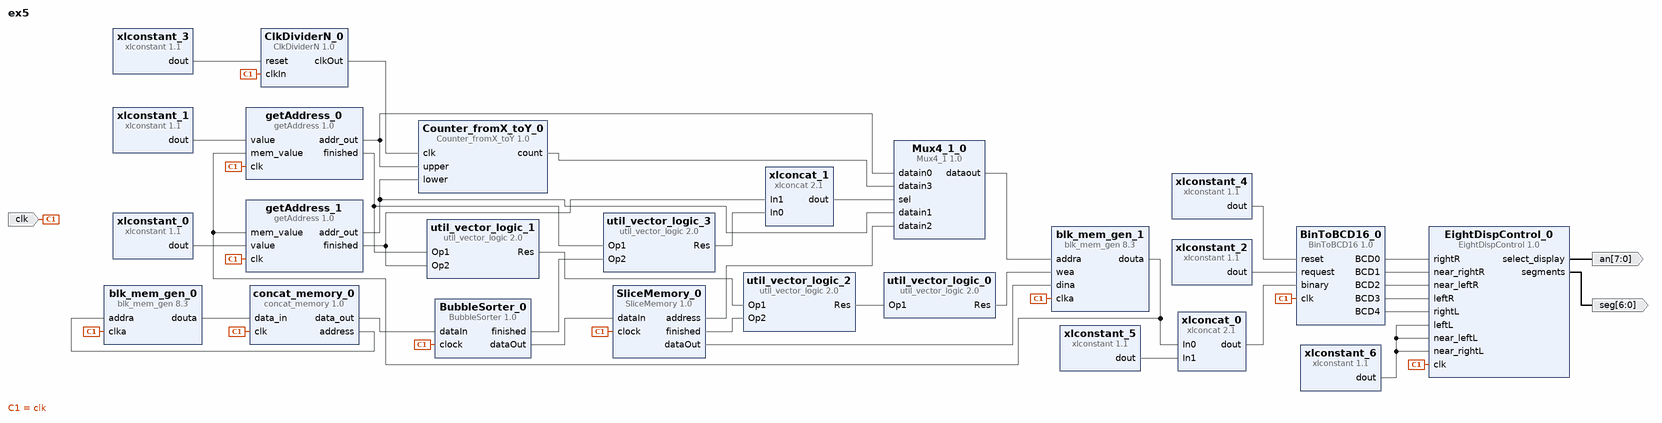
[diagram p0: block diagram of the top level]
# Vivado block design ex5, xc7a100tcsg324-3, Vivado 2016.4
create_bd_design ex5

create_bd_port -dir I clk
create_bd_port -dir O -from 6 -to 0 seg
create_bd_port -dir O -from 7 -to 0 an

create_bd_cell -type ip -vlnv xilinx.com:ip:xlconstant:1.1 xlconstant_1
set_property -dict {CONFIG.CONST_WIDTH 8 CONFIG.CONST_VAL 120} [get_bd_cells xlconstant_1]
create_bd_cell -type ip -vlnv xilinx.com:ip:xlconstant:1.1 xlconstant_0
set_property -dict {CONFIG.CONST_WIDTH 8 CONFIG.CONST_VAL 44} [get_bd_cells xlconstant_0]
create_bd_cell -type ip -vlnv xilinx.com:user:getAddress:1.0 getAddress_0
create_bd_cell -type ip -vlnv xilinx.com:user:Counter_fromX_toY:1.0 Counter_fromX_toY_0
create_bd_cell -type ip -vlnv xilinx.com:user:getAddress:1.0 getAddress_1
create_bd_cell -type ip -vlnv xilinx.com:user:Mux4_1:1.0 Mux4_1_0
create_bd_cell -type ip -vlnv xilinx.com:ip:xlconcat:2.1 xlconcat_1
set_property -dict {CONFIG.IN0_WIDTH 1 CONFIG.IN1_WIDTH 1} [get_bd_cells xlconcat_1]
create_bd_cell -type ip -vlnv xilinx.com:user:ClkDividerN:1.0 ClkDividerN_0
set_property -dict {CONFIG.divFactor 100000000} [get_bd_cells ClkDividerN_0]
create_bd_cell -type ip -vlnv xilinx.com:ip:xlconstant:1.1 xlconstant_3
set_property -dict {CONFIG.CONST_VAL 0} [get_bd_cells xlconstant_3]
create_bd_cell -type ip -vlnv xilinx.com:ip:blk_mem_gen:8.3 blk_mem_gen_0
set_property -dict [list \
  CONFIG.Memory_Type Single_Port_ROM \
  CONFIG.Enable_32bit_Address false \
  CONFIG.Write_Width_A 8 \
  CONFIG.Enable_A Always_Enabled \
  CONFIG.Register_PortA_Output_of_Memory_Primitives true \
  CONFIG.Load_Init_File true \
  CONFIG.Coe_File ../../../../../../../ex1/vector16_8bits_random.coe \
  CONFIG.Use_RSTA_Pin false \
  CONFIG.Port_A_Write_Rate 0 \
  CONFIG.use_bram_block Stand_Alone \
] [get_bd_cells blk_mem_gen_0]
create_bd_cell -type ip -vlnv xilinx.com:user:concat_memory:1.0 concat_memory_0
set_property -dict {CONFIG.bits 8 CONFIG.words 16 CONFIG.log_words 4} [get_bd_cells concat_memory_0]
create_bd_cell -type ip -vlnv xilinx.com:ip:blk_mem_gen:8.3 blk_mem_gen_1
set_property -dict [list \
  CONFIG.Enable_32bit_Address false \
  CONFIG.Use_Byte_Write_Enable false \
  CONFIG.Write_Width_A 8 \
  CONFIG.Read_Width_A 8 \
  CONFIG.Enable_A Always_Enabled \
  CONFIG.Register_PortA_Output_of_Memory_Primitives true \
  CONFIG.Use_RSTA_Pin false \
  CONFIG.use_bram_block Stand_Alone \
] [get_bd_cells blk_mem_gen_1]
create_bd_cell -type ip -vlnv xilinx.com:user:BubbleSorter:1.0 BubbleSorter_0
create_bd_cell -type ip -vlnv xilinx.com:ip:util_vector_logic:2.0 util_vector_logic_1
set_property -dict {CONFIG.C_SIZE 1} [get_bd_cells util_vector_logic_1]
create_bd_cell -type ip -vlnv xilinx.com:ip:util_vector_logic:2.0 util_vector_logic_0
set_property -dict {CONFIG.C_SIZE 1 CONFIG.C_OPERATION not} [get_bd_cells util_vector_logic_0]
create_bd_cell -type ip -vlnv xilinx.com:ip:util_vector_logic:2.0 util_vector_logic_3
set_property -dict {CONFIG.C_SIZE 1} [get_bd_cells util_vector_logic_3]
create_bd_cell -type ip -vlnv ua.pt:user:EightDispControl:1.0 EightDispControl_0
create_bd_cell -type ip -vlnv ua.pt:user:BinToBCD16:1.0 BinToBCD16_0
create_bd_cell -type ip -vlnv xilinx.com:ip:xlconstant:1.1 xlconstant_2
create_bd_cell -type ip -vlnv xilinx.com:ip:xlconstant:1.1 xlconstant_4
set_property -dict {CONFIG.CONST_VAL 0} [get_bd_cells xlconstant_4]
create_bd_cell -type ip -vlnv xilinx.com:ip:xlconcat:2.1 xlconcat_0
set_property -dict {CONFIG.IN0_WIDTH 8 CONFIG.IN1_WIDTH 8} [get_bd_cells xlconcat_0]
create_bd_cell -type ip -vlnv xilinx.com:ip:xlconstant:1.1 xlconstant_5
set_property -dict {CONFIG.CONST_WIDTH 8 CONFIG.CONST_VAL 0} [get_bd_cells xlconstant_5]
create_bd_cell -type ip -vlnv xilinx.com:ip:xlconstant:1.1 xlconstant_6
set_property -dict {CONFIG.CONST_WIDTH 4 CONFIG.CONST_VAL 0} [get_bd_cells xlconstant_6]
create_bd_cell -type ip -vlnv xilinx.com:ip:util_vector_logic:2.0 util_vector_logic_2
set_property -dict {CONFIG.C_SIZE 1} [get_bd_cells util_vector_logic_2]
create_bd_cell -type ip -vlnv xilinx.com:user:SliceMemory:1.0 SliceMemory_0

# ---- connections ----

connect_bd_net [get_bd_pins xlconstant_1/dout] [get_bd_pins getAddress_0/value]
connect_bd_net [get_bd_ports clk] \
  [get_bd_pins getAddress_0/clk] [get_bd_pins ClkDividerN_0/clkIn] [get_bd_pins blk_mem_gen_0/clka] \
  [get_bd_pins getAddress_1/clk] [get_bd_pins concat_memory_0/clk] [get_bd_pins blk_mem_gen_1/clka] \
  [get_bd_pins BubbleSorter_0/clock] [get_bd_pins BinToBCD16_0/clk] [get_bd_pins EightDispControl_0/clk] \
  [get_bd_pins SliceMemory_0/clock]
connect_bd_net [get_bd_pins getAddress_0/addr_out] [get_bd_pins Mux4_1_0/datain0] [get_bd_pins Counter_fromX_toY_0/upper]
connect_bd_net [get_bd_pins getAddress_1/addr_out] [get_bd_pins Mux4_1_0/datain1] [get_bd_pins Counter_fromX_toY_0/lower]
connect_bd_net [get_bd_pins getAddress_1/finished] [get_bd_pins xlconcat_1/In1] [get_bd_pins util_vector_logic_1/Op2]
connect_bd_net [get_bd_pins xlconcat_1/dout] [get_bd_pins Mux4_1_0/sel]
connect_bd_net [get_bd_pins ClkDividerN_0/clkOut] [get_bd_pins Counter_fromX_toY_0/clk]
connect_bd_net [get_bd_pins xlconstant_3/dout] [get_bd_pins ClkDividerN_0/reset]
connect_bd_net [get_bd_pins blk_mem_gen_0/douta] [get_bd_pins concat_memory_0/data_in]
connect_bd_net [get_bd_pins concat_memory_0/address] [get_bd_pins blk_mem_gen_0/addra]
connect_bd_net [get_bd_pins concat_memory_0/data_out] [get_bd_pins BubbleSorter_0/dataIn]
connect_bd_net [get_bd_pins BubbleSorter_0/dataOut] [get_bd_pins SliceMemory_0/dataIn]
connect_bd_net [get_bd_pins SliceMemory_0/dataOut] [get_bd_pins blk_mem_gen_1/dina]
connect_bd_net [get_bd_pins util_vector_logic_0/Res] [get_bd_pins blk_mem_gen_1/wea]
connect_bd_net [get_bd_pins Mux4_1_0/dataout] [get_bd_pins blk_mem_gen_1/addra]
connect_bd_net [get_bd_pins Counter_fromX_toY_0/count] [get_bd_pins Mux4_1_0/datain3]
connect_bd_net [get_bd_pins SliceMemory_0/address] [get_bd_pins Mux4_1_0/datain2]
connect_bd_net [get_bd_pins getAddress_0/finished] [get_bd_pins util_vector_logic_1/Op1] [get_bd_pins util_vector_logic_3/Op1]
connect_bd_net [get_bd_pins BubbleSorter_0/finished] [get_bd_pins util_vector_logic_3/Op2]
connect_bd_net [get_bd_pins util_vector_logic_3/Res] [get_bd_pins xlconcat_1/In0]
connect_bd_net [get_bd_pins xlconstant_0/dout] [get_bd_pins getAddress_1/value]
connect_bd_net [get_bd_pins blk_mem_gen_1/douta] \
  [get_bd_pins getAddress_1/mem_value] [get_bd_pins getAddress_0/mem_value] [get_bd_pins xlconcat_0/In0]
connect_bd_net [get_bd_pins xlconstant_4/dout] [get_bd_pins BinToBCD16_0/reset]
connect_bd_net [get_bd_pins xlconstant_2/dout] [get_bd_pins BinToBCD16_0/request]
connect_bd_net [get_bd_pins xlconstant_5/dout] [get_bd_pins xlconcat_0/In1]
connect_bd_net [get_bd_pins xlconcat_0/dout] [get_bd_pins BinToBCD16_0/binary]
connect_bd_net [get_bd_pins BinToBCD16_0/BCD0] [get_bd_pins EightDispControl_0/rightR]
connect_bd_net [get_bd_pins BinToBCD16_0/BCD1] [get_bd_pins EightDispControl_0/near_rightR]
connect_bd_net [get_bd_pins BinToBCD16_0/BCD2] [get_bd_pins EightDispControl_0/near_leftR]
connect_bd_net [get_bd_pins BinToBCD16_0/BCD3] [get_bd_pins EightDispControl_0/leftR]
connect_bd_net [get_bd_pins BinToBCD16_0/BCD4] [get_bd_pins EightDispControl_0/rightL]
connect_bd_net [get_bd_pins xlconstant_6/dout] \
  [get_bd_pins EightDispControl_0/near_rightL] [get_bd_pins EightDispControl_0/near_leftL] \
  [get_bd_pins EightDispControl_0/leftL]
connect_bd_net [get_bd_pins EightDispControl_0/segments] [get_bd_ports seg]
connect_bd_net [get_bd_pins EightDispControl_0/select_display] [get_bd_ports an]
connect_bd_net [get_bd_pins util_vector_logic_2/Res] [get_bd_pins util_vector_logic_0/Op1]
connect_bd_net [get_bd_pins util_vector_logic_1/Res] [get_bd_pins util_vector_logic_2/Op1]
connect_bd_net [get_bd_pins SliceMemory_0/finished] [get_bd_pins util_vector_logic_2/Op2]

validate_bd_design
save_bd_design
